# EasyEDA schematic Ultrasonic Distance Measurment Schematic.json
TITLE: ULTRASONIC DISTANCE MEASURMENT; REV: 1.0; Date: 2024-02-19; Sheet: 1/1; Drawn By: Akshay S; Company: NCAIR
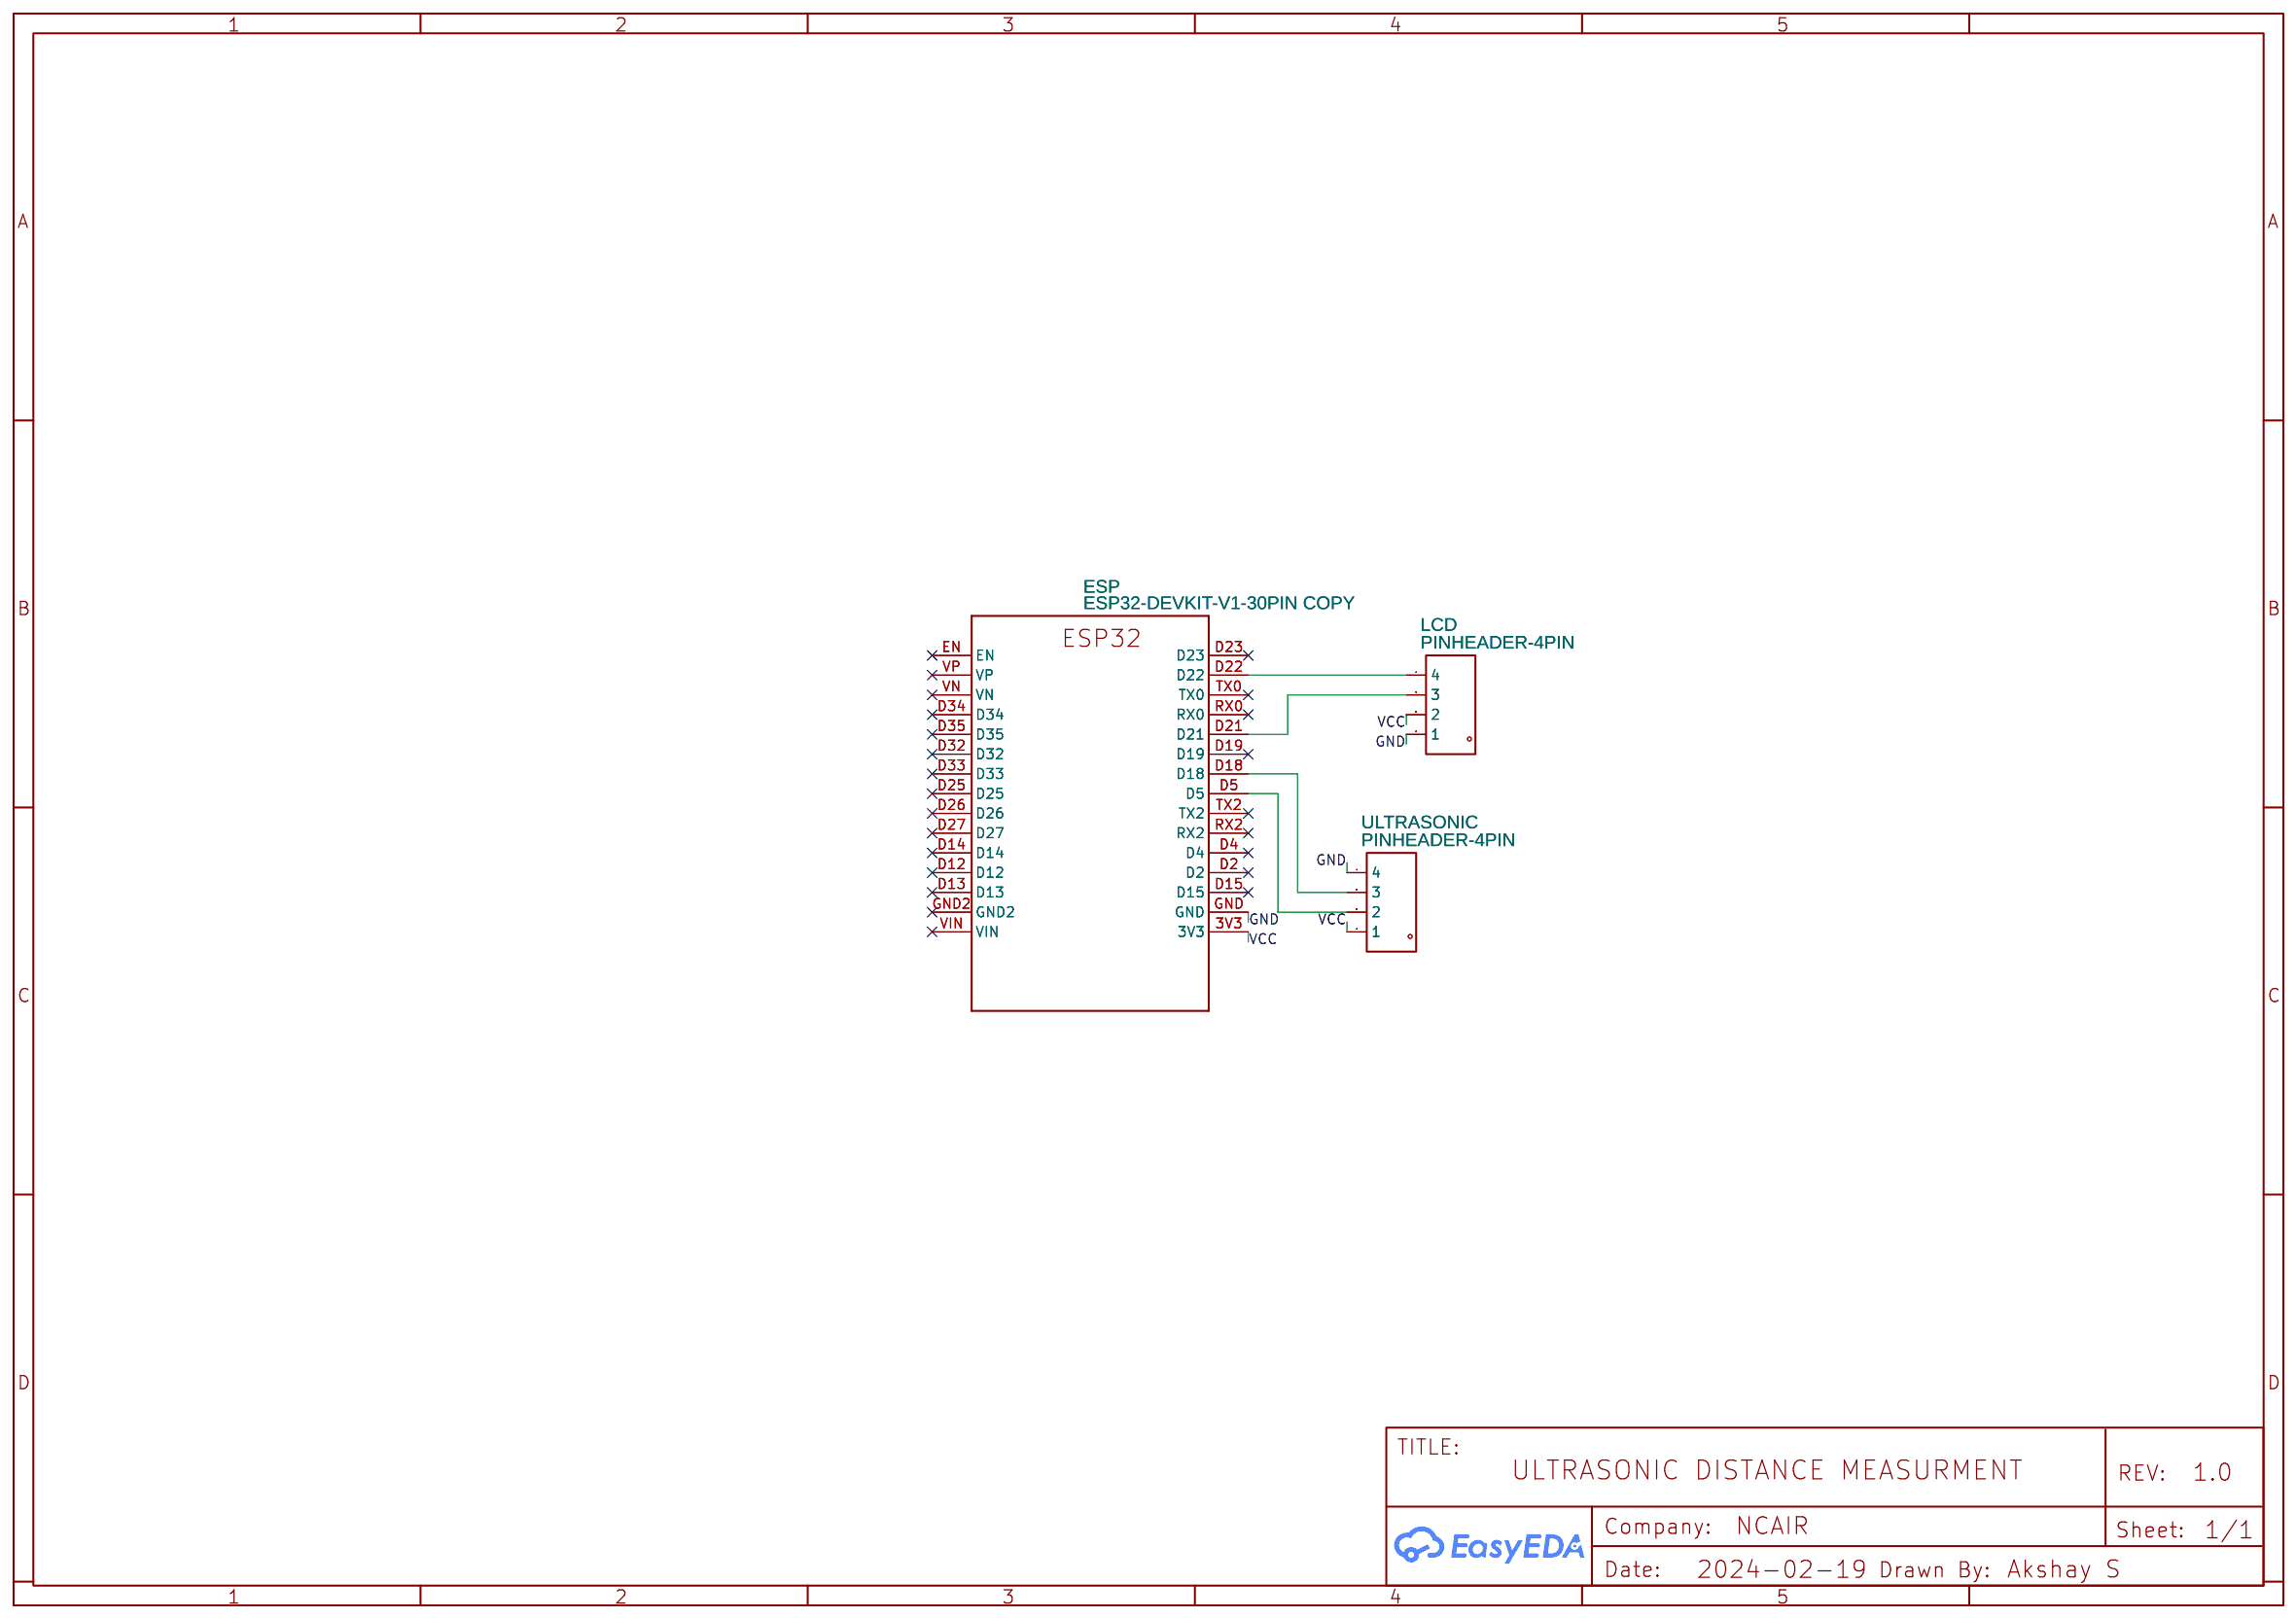
[diagram p0: schematic sheet]

## Parts
ESP  ESP32-DEVKIT-V1-30PIN COPY  [ESP32-DEVKITV1_ESP32-DEVKITV1]
LCD  PINHEADER-4PIN  [PINHEADER-4PIN]
ULTRASONIC  PINHEADER-4PIN  [PINHEADER-4PIN]

## Library data of the parts
ESP = ESP32-DEVKIT-V1-30PIN: Contributor: KiraKira san
LCD ULTRASONIC = PINHEADER-4PIN: Contributor: mKenfenheuer

## Nets
GND: ESP.GND LCD.1 ULTRASONIC.4
VCC: ESP.3V3 LCD.2 ULTRASONIC.1
Net-(ESP-D5): ESP.D5 ULTRASONIC.2
Net-(ESP-D18): ESP.D18 ULTRASONIC.3
Net-(ESP-D21): ESP.D21 LCD.3
Net-(ESP-D22): ESP.D22 LCD.4

Not connected (* = marked no-connect by the designer): ESP D2* D4* D12* D13* D14* D15* D19* D23* D25* D26* D27* D32* D33* D34* D35* EN* GND2* RX0* RX2* TX0* TX2* VIN* VN* VP*
